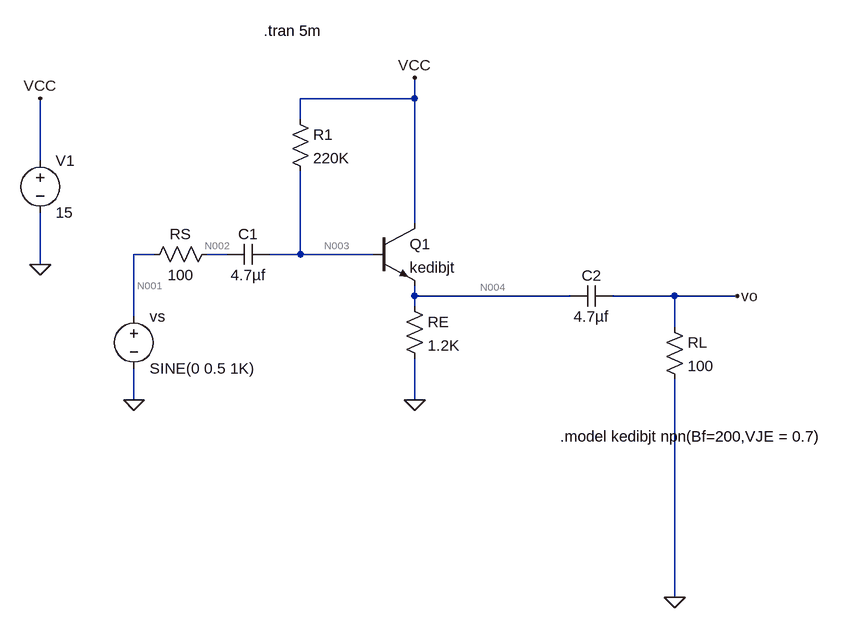
[diagram p0: schematic exp52a.asc]
exp52a.asc, the LTspice schematic file:
Version 4
SHEET 1 904 680
WIRE 32 -160 32 -192
WIRE 32 -160 -144 -160
WIRE -144 -128 -144 -160
WIRE -544 -64 -544 -160
WIRE 32 32 32 -160
WIRE -368 80 -400 80
WIRE -256 80 -288 80
WIRE -144 80 -144 -48
WIRE -144 80 -192 80
WIRE -32 80 -144 80
WIRE -544 96 -544 16
WIRE 32 144 32 128
WIRE 272 144 32 144
WIRE 432 144 336 144
WIRE 528 144 432 144
WIRE 32 160 32 144
WIRE -400 176 -400 80
WIRE 432 192 432 144
WIRE -400 304 -400 256
WIRE 32 304 32 240
WIRE 432 608 432 272
FLAG -544 96 0
FLAG -544 -160 VCC
FLAG 32 -192 VCC
FLAG 32 304 0
FLAG -400 304 0
FLAG 432 608 0
FLAG 528 144 vo
SYMBOL npn -32 32 R0
SYMATTR InstName Q1
SYMATTR Value kedibjt
SYMBOL voltage -544 -80 R0
SYMATTR InstName V1
SYMATTR Value 15
SYMBOL res -160 -144 R0
SYMATTR InstName R1
SYMATTR Value 220K
SYMBOL res 16 144 R0
SYMATTR InstName RE
SYMATTR Value 1.2K
SYMBOL res -272 64 R90
WINDOW 0 0 56 VBottom 2
WINDOW 3 32 56 VTop 2
SYMATTR InstName RS
SYMATTR Value 100
SYMBOL cap -192 64 R90
WINDOW 0 0 32 VBottom 2
WINDOW 3 32 32 VTop 2
SYMATTR InstName C1
SYMATTR Value 4.7µf
SYMBOL cap 336 128 R90
WINDOW 0 0 32 VBottom 2
WINDOW 3 32 32 VTop 2
SYMATTR InstName C2
SYMATTR Value 4.7µf
SYMBOL voltage -400 160 R0
WINDOW 123 0 0 Left 0
WINDOW 39 0 0 Left 0
SYMATTR InstName vs
SYMATTR Value SINE(0 0.5 1K)
SYMBOL res 416 176 R0
SYMATTR InstName RL
SYMATTR Value 100
TEXT 256 360 Left 2 !.model kedibjt npn(Bf=200,VJE = 0.7)
TEXT -200 -264 Left 2 !.tran 5m

The netlist it stands for:
* exp52a.asc
Q1 VCC N003 N004 0 kedibjt
V1 VCC 0 15
R1 VCC N003 220K
RE N004 0 1.2K
RS N002 N001 100
C1 N003 N002 4.7µf
C2 vo N004 4.7µf
vs N001 0 SINE(0 0.5 1K)
RL vo 0 100
.model NPN NPN
.model PNP PNP
.lib standard.bjt
.model kedibjt npn(Bf=200,VJE = 0.7)
.tran 5m
.backanno
.end

* Results of the author's LTspice run, read from the files saved beside the schematic
* Operating Point, zero values left out:
*   V(vcc) = 15 V
*   V(n003) = 8.236 V
*   V(n004) = 7.415 V
*   Ic(Q1) = 6.149 mA
*   Ib(Q1) = 30.74 µA
*   Ie(Q1) = -6.179 mA
*   I(Re) = 6.179 mA
*   I(R1) = 30.74 µA
*   I(V1) = -6.179 mA
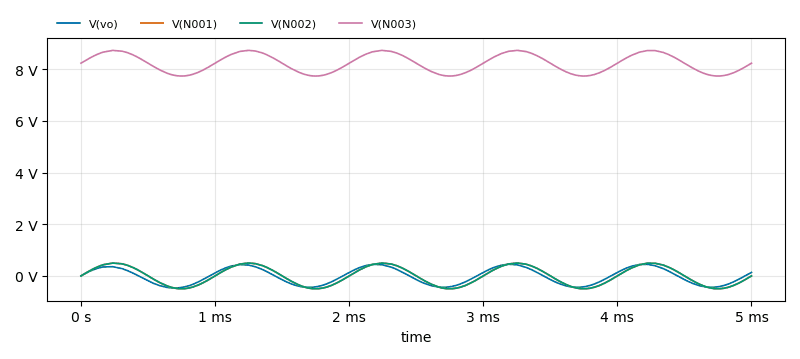
[diagram p1: Transient Analysis of exp52a.asc, plotted from the saved traces]
* Transient Analysis, 1 run:
*   V(vo): min -469 mV, max 451.1 mV, average -14.19 mV, rms 311.3 mV, last 134.9 mV
*   V(N001): min -500 mV, max 500 mV, average -1.142 mV, rms 352.5 mV, last 0 V
*   V(N002): min -497.4 mV, max 497.4 mV, average -1.073 mV, rms 350.6 mV, last -669.2 µV
*   V(N003): min 7.739 V, max 8.733 V, average 8.235 V, rms 8.243 V, last 8.236 V